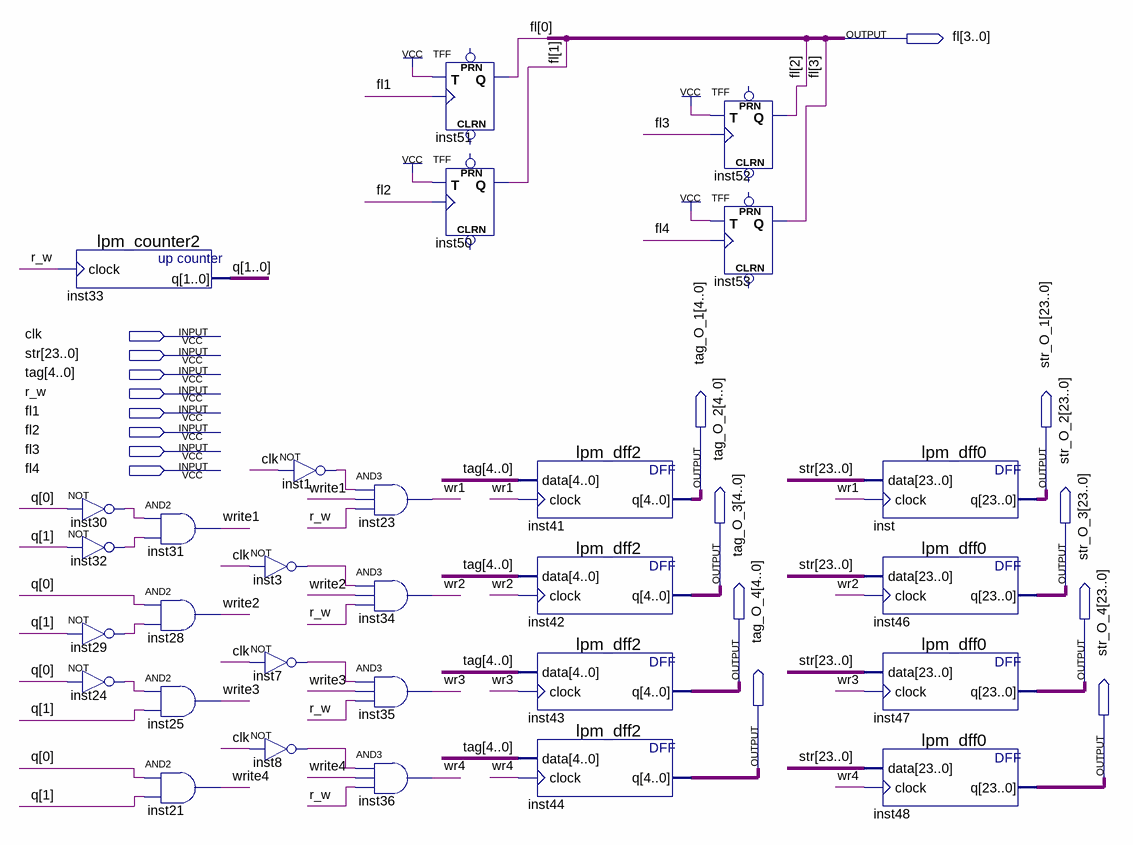
[diagram p0: schematic sheet]
// Quartus schematic cash_block.bdf as structural Verilog: 29 symbols, 17 pins
module cash_block (
  input  clk,
  input  [23:0] str,
  input  [4:0] tag,
  input  r_w,
  input  fl1,
  input  fl2,
  input  fl3,
  input  fl4,
  output [3:0] fl,
  output [4:0] tag_O_1,
  output [23:0] str_O_1,
  output [4:0] tag_O_2,
  output [23:0] str_O_2,
  output [4:0] tag_O_3,
  output [23:0] str_O_3,
  output [4:0] tag_O_4,
  output [23:0] str_O_4
);

  wire inst1_out, inst3_out, inst7_out, inst8_out, inst24_out, inst29_out, inst30_out, inst32_out, wr1, wr2,
       wr3, wr4, write1, write2, write3, write4;
  wire [1:0] q;

  lpm_counter2 inst33 (.clock(r_w), .q(q));
  not inst30 (inst30_out, q[0]);
  not inst32 (inst32_out, q[1]);
  not inst29 (inst29_out, q[1]);
  not inst24 (inst24_out, q[0]);
  and inst31 (write1, inst30_out, inst32_out);
  and inst28 (write2, q[0], inst29_out);
  and inst25 (write3, inst24_out, q[1]);
  and inst21 (write4, q[0], q[1]);
  not inst1 (inst1_out, clk);
  not inst3 (inst3_out, clk);
  not inst7 (inst7_out, clk);
  not inst8 (inst8_out, clk);
  and inst23 (wr1, inst1_out, write1, r_w);
  and inst34 (wr2, inst3_out, write2, r_w);
  and inst35 (wr3, inst7_out, write3, r_w);
  and inst36 (wr4, inst8_out, write4, r_w);
  TFF inst51 (.T(1'b1), .CLK(fl1), .Q(fl[0]));  // open: PRN, CLRN
  TFF inst50 (.T(1'b1), .CLK(fl2), .Q(fl1));  // open: PRN, CLRN
  lpm_dff2 inst41 (.data(tag), .clock(wr1), .q(tag_O_1));
  lpm_dff2 inst42 (.data(tag), .clock(wr2), .q(tag_O_2));
  lpm_dff2 inst43 (.data(tag), .clock(wr3), .q(tag_O_3));
  lpm_dff2 inst44 (.data(tag), .clock(wr4), .q(tag_O_4));
  TFF inst52 (.T(1'b1), .CLK(fl3), .Q(fl2));  // open: PRN, CLRN
  TFF inst53 (.T(1'b1), .CLK(fl4), .Q(fl3));  // open: PRN, CLRN
  lpm_dff0 inst (.data(str), .clock(wr1), .q(str_O_1));
  lpm_dff0 inst46 (.data(str), .clock(wr2), .q(str_O_2));
  lpm_dff0 inst47 (.data(str), .clock(wr3), .q(str_O_3));
  lpm_dff0 inst48 (.data(str), .clock(wr4), .q(str_O_4));

  assign fl[3:1] = {fl3, fl2, fl1};
endmodule
